# Altium project Multifunctional Probe.PrjPcb
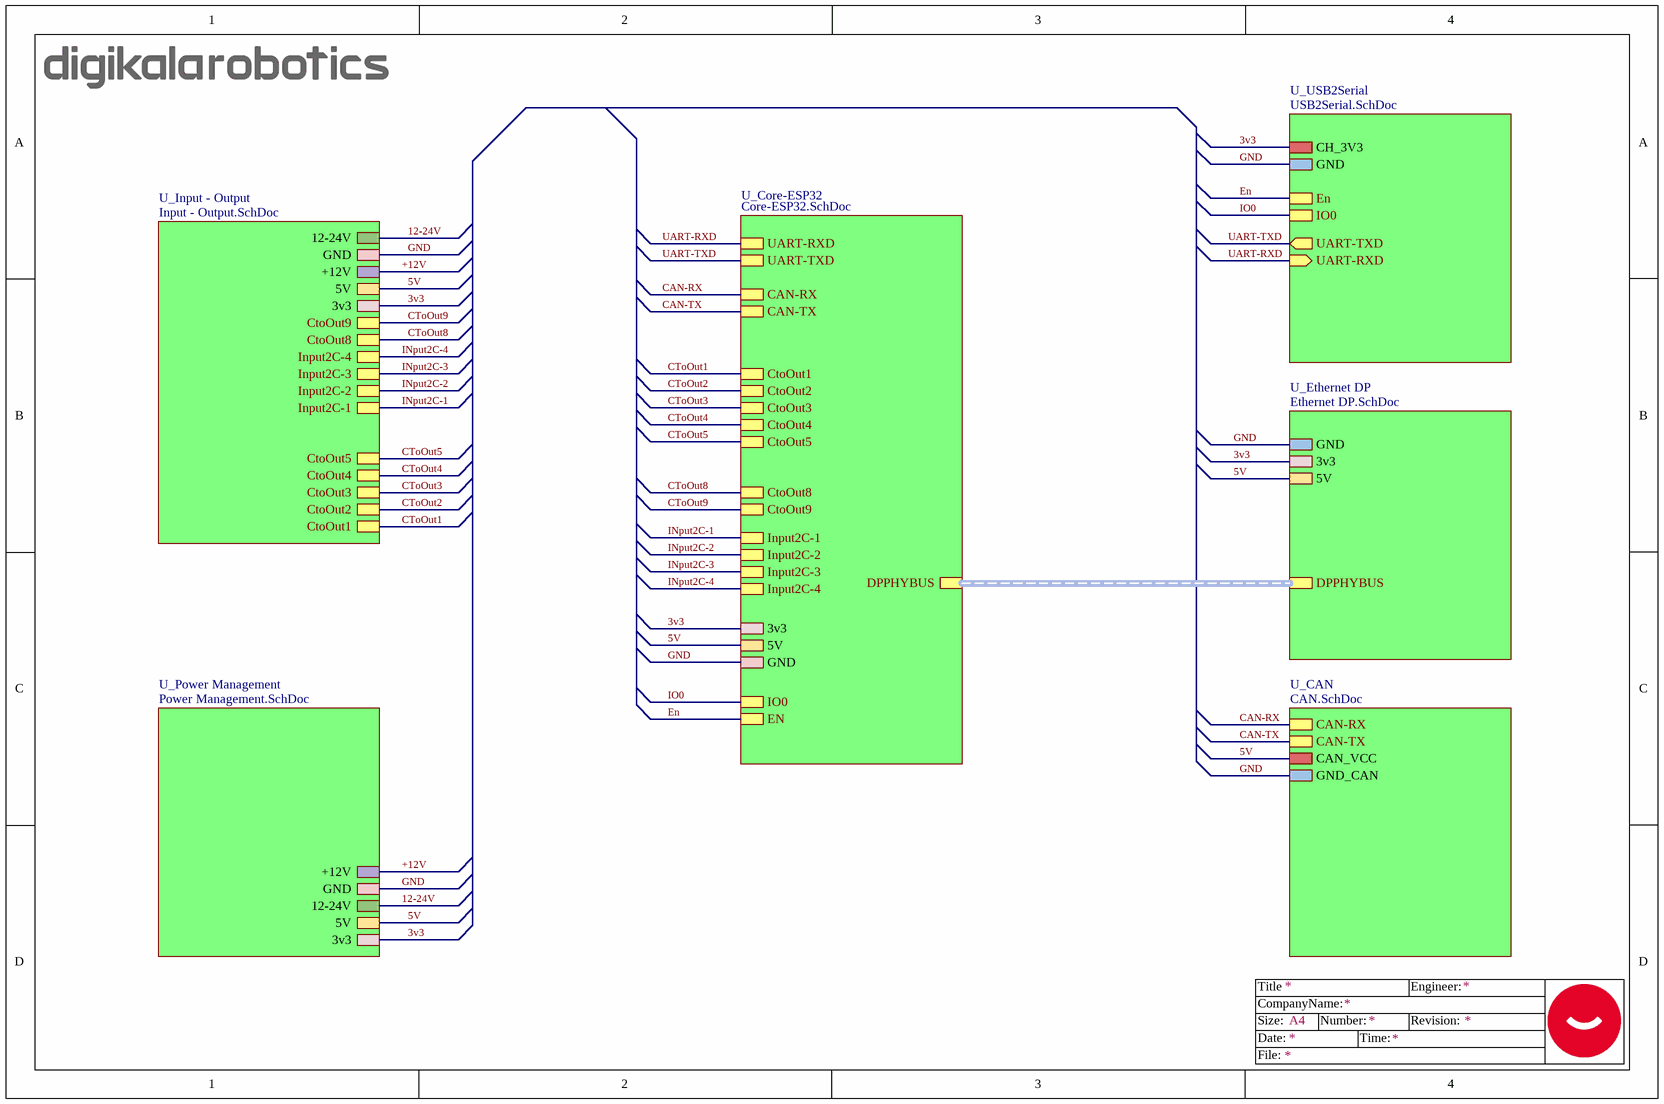
[diagram p0: Dashboard - Multifunctional Probe.SchDoc]
7 sheets, 199 parts. Net scope: hierarchical (ports join the sheet entries above them; power ports are global).
Board file: Multifunctional Probe.PcbDoc
Sheets:
  Dashboard - Multifunctional Probe.SchDoc
    U_CAN = CAN.SchDoc
    U_Core-ESP32 = Core-ESP32.SchDoc
    U_Ethernet DP = Ethernet DP.SchDoc
    U_USB2Serial = USB2Serial.SchDoc
    U_Power Management = Power Management.SchDoc
    U_Input - Output = Input - Output.SchDoc

## Sheet Dashboard - Multifunctional Probe.SchDoc
size A4; SheetNumber: 1; SheetTotal: 7

### Sub-sheets
U_CAN = CAN.SchDoc: CAN-RX, CAN-TX, CAN_VCC, GND_CAN
U_Core-ESP32 = Core-ESP32.SchDoc: UART-RXD, UART-TXD, DPPHYBUS (harness DPPHYBUS), CAN-RX, CAN-TX, CtoOut1, CtoOut2, CtoOut3, CtoOut4, CtoOut8, Input2C-1, Input2C-2, Input2C-3, Input2C-4, 3v3, 5V, GND, CtoOut9, IO0, EN, CtoOut5
U_Ethernet DP = Ethernet DP.SchDoc: DPPHYBUS (harness DPPHYBUS), GND, 3v3, 5V
U_Input - Output = Input - Output.SchDoc: CtoOut1, CtoOut2, CtoOut3, CtoOut4, Input2C-1, Input2C-2, Input2C-3, Input2C-4, CtoOut8, CtoOut9, 3v3, 5V, +12V, GND, 12-24V, CtoOut5
U_Power Management = Power Management.SchDoc: 3v3, 5V, 12-24V, GND, +12V
U_USB2Serial = USB2Serial.SchDoc: CH_3V3, UART-RXD (in), UART-TXD (out), GND, En, IO0

### Nets
3v3: sheet U_Core-ESP32/3v3, sheet U_Ethernet DP/3v3, sheet U_USB2Serial/CH_3V3, sheet U_Power Management/3v3, sheet U_Input - Output/3v3
5V: sheet U_CAN/CAN_VCC, sheet U_Core-ESP32/5V, sheet U_Ethernet DP/5V, sheet U_Power Management/5V, sheet U_Input - Output/5V
12-24V: sheet U_Power Management/12-24V, sheet U_Input - Output/12-24V
+12V: sheet U_Power Management/+12V, sheet U_Input - Output/+12V
GND: sheet U_CAN/GND_CAN, sheet U_Core-ESP32/GND, sheet U_Ethernet DP/GND, sheet U_USB2Serial/GND, sheet U_Power Management/GND, sheet U_Input - Output/GND
CAN-RX: sheet U_CAN/CAN-RX, sheet U_Core-ESP32/CAN-RX
CAN-TX: sheet U_CAN/CAN-TX, sheet U_Core-ESP32/CAN-TX
CToOut1: sheet U_Core-ESP32/CtoOut1, sheet U_Input - Output/CtoOut1
CToOut2: sheet U_Core-ESP32/CtoOut2, sheet U_Input - Output/CtoOut2
CToOut3: sheet U_Core-ESP32/CtoOut3, sheet U_Input - Output/CtoOut3
CToOut4: sheet U_Core-ESP32/CtoOut4, sheet U_Input - Output/CtoOut4
CToOut5: sheet U_Core-ESP32/CtoOut5, sheet U_Input - Output/CtoOut5
CToOut8: sheet U_Core-ESP32/CtoOut8, sheet U_Input - Output/CtoOut8
CToOut9: sheet U_Core-ESP32/CtoOut9, sheet U_Input - Output/CtoOut9
En: sheet U_Core-ESP32/EN, sheet U_USB2Serial/En
INput2C-1: sheet U_Core-ESP32/Input2C-1, sheet U_Input - Output/Input2C-1
INput2C-2: sheet U_Core-ESP32/Input2C-2, sheet U_Input - Output/Input2C-2
INput2C-3: sheet U_Core-ESP32/Input2C-3, sheet U_Input - Output/Input2C-3
INput2C-4: sheet U_Core-ESP32/Input2C-4, sheet U_Input - Output/Input2C-4
IO0: sheet U_Core-ESP32/IO0, sheet U_USB2Serial/IO0  [project net ETH_CLK_IN]
UART-RXD: sheet U_Core-ESP32/UART-RXD, sheet U_USB2Serial/UART-RXD
UART-TXD: sheet U_Core-ESP32/UART-TXD, sheet U_USB2Serial/UART-TXD

### Buses and harness runs
harness sheet U_Core-ESP32/DPPHYBUS = sheet U_Ethernet DP/DPPHYBUS

### Notes on the sheet
- Title
- Size:
- Date:
- CompanyName:
- A4
- Number:
- Time:
- Revision:
- Engineer:
- File:

## Sheet CAN.SchDoc
size A4; SheetNumber: 3; SheetTotal: 7
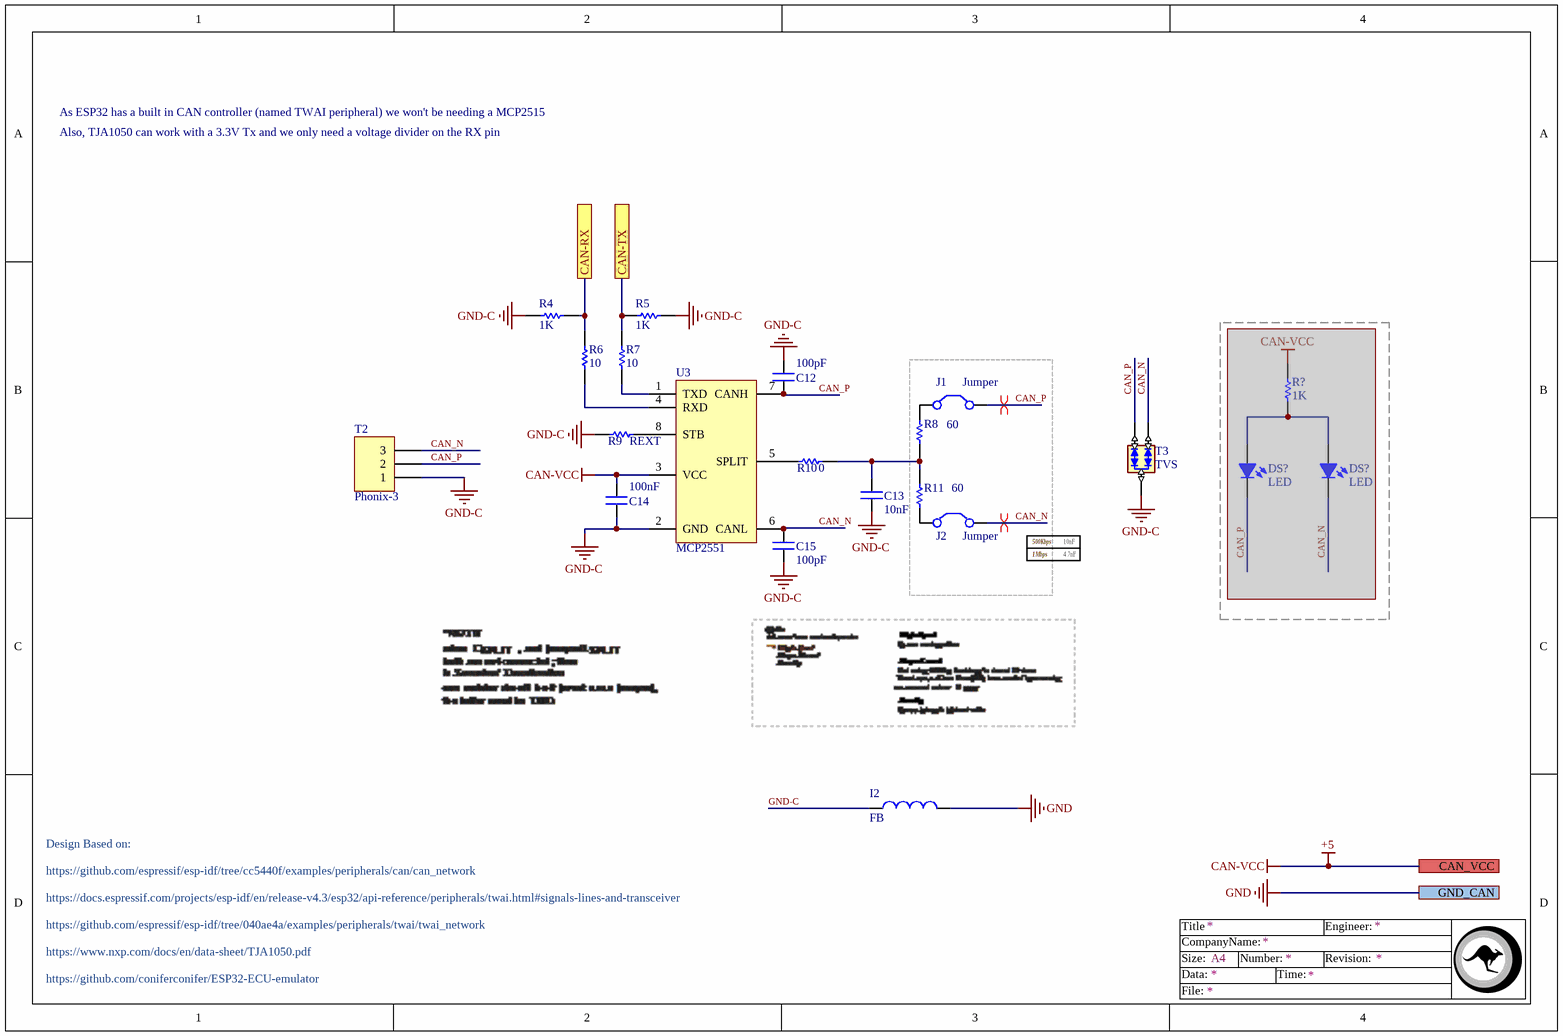
[diagram p1: CAN.SchDoc]

### Parts
(Parts that share a designator on the sheet are numbered #1, #2 ... from top to bottom, then left to right.)
C12  100pF  [Cap0805]
C13  10nF  [Cap0805]
C14  100nF  [Cap0805]
C15  100pF  [Cap0805]
DS?#1  LED  [LED_0805Green]  (masked out: inside a compile mask, not in the netlist)
DS?#2  LED  [LED_0805Green]  (masked out: inside a compile mask, not in the netlist)
I2  FB  [1206]
J1  Jumper  [Jumper Small - 2.54 - Blue]
J2  Jumper  [Jumper Small - 2.54 - Blue]
R4  1K  [R0805]
R5  1K  [R0805]
R6  10  [R0805]
R7  10  [R0805]
R8  60  [R0805]
R9  REXT  [R0805]
R10  0  [R0805]
R11#1  60  [R0805]
R?  1K  [R0805]  (masked out: inside a compile mask, not in the netlist)
T2  Phonix-3  [Phonix-3]
T3  TVS  [SOT23]
U3  MCP2551  [SO4]

### Ports
CAN-RX (see Dashboard - Multifunctional Probe[4C], Core-ESP32[3B]), CAN-TX (see Dashboard - Multifunctional Probe[4C], Core-ESP32[3A]), CAN_VCC (see Dashboard - Multifunctional Probe[4C]), GND_CAN (see Dashboard - Multifunctional Probe[4C])

### Nets
+5: C14.1 U3.3(VCC) ; port CAN_VCC  [also labelled CAN-VCC]  [project net 5V]
GND: I2.2 ; port GND_CAN
GND-C: C12.1 C13.1 C14.2 C15.1 I2.1 R4.2 R5.1 R9.2 T2.1 T3.1(GND) U3.2(GND)
CAN-RX: R4.1 R6.2 ; port CAN-RX
CAN-TX: R5.2 R7.2 ; port CAN-TX
CAN_N: C15.2 J2.2(C2) T2.3 T3.2(CANH) U3.6(CANL)
CAN_P: C12.2 J1.2(C2) T2.2 T3.3(CANL) U3.7(CANH)
NetC13_2: C13.2 R8.2 R10.1 R11#1.2
NetJ1_1: J1.1(C1) R8.1
NetJ2_1: J2.1(C1) R11#1.1
NetR6_1: R6.1 U3.4(RXD)
NetR7_1: R7.1 U3.1(TXD)
NetR9_1: R9.1 U3.8(STB)
NetR10_2: R10.2 U3.5(SPLIT)

### Layout directives
differential pair: CAN_N, CAN_P

### Notes on the sheet
- As ESP32 has a built in CAN controller (named TWAI peripheral) we won't be needing a MCP2515
- Also, TJA1050 can work with a 3.3V Tx and we only need a voltage divider on the RX pin
- Design Based on:
  https://github.com/espressif/esp-idf/tree/cc5440f/examples/peripherals/can/can_network
  https://docs.espressif.com/projects/esp-idf/en/release-v4.3/esp32/api-reference/peripherals/twai.html#signals-lines-and-transceiver
  https://github.com/espressif/esp-idf/tree/040ae4a/examples/peripherals/twai/twai_network
  https://www.nxp.com/docs/en/data-sheet/TJA1050.pdf
  https://github.com/coniferconifer/ESP32-ECU-emulator
- Title
- Size:
- Data:
- CompanyName:
- A4
- Number:
- Time:
- Revision:
- Engineer:
- File:

### Library data of the parts
C12-C15 = Cap: Surface mount Capacitor
I2 = Inductor: Indicator
R4-R10 R11#1 R? = Resistor
T2 = Phonix-3: Connector
T3 = ESD
U3 = MCP2551: CAN IC

## Sheet Core-ESP32.SchDoc
size A4; SheetNumber: 6; SheetTotal: 7
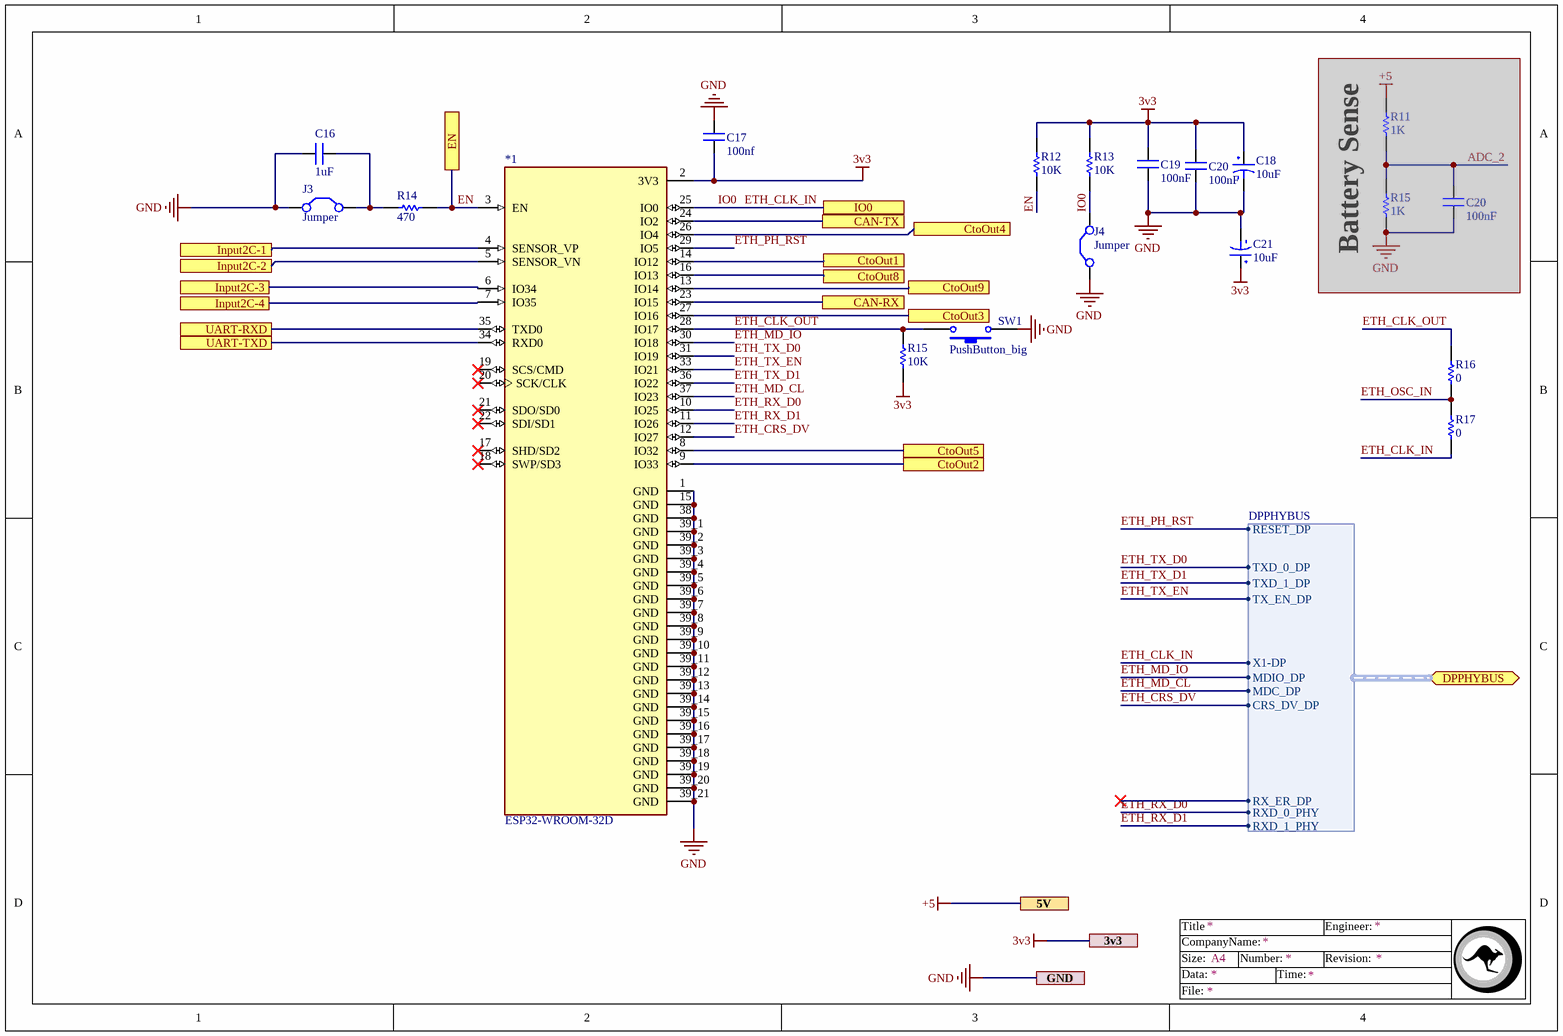
[diagram p2: Core-ESP32.SchDoc]

### Parts
(Parts that share a designator on the sheet are numbered #1, #2 ... from top to bottom, then left to right.)
*1  ESP32-WROOM-32D  [ESP32-Wroom-32D]
C16  1uF  [Cap0805]
C17  100nf  [Cap0805]
C18  10uF  [CAPMOL_B]
C19  100nF  [Cap0805]
C20#1  100nF  [Cap0805]
C20#2  100nF  [Cap0805]  (masked out: inside a compile mask, not in the netlist)
C21  10uF  [CAPMOL_B]
J3  Jumper  [Jumper Small - 2.54 - Blue]
J4  Jumper  [Jumper]
R11#2  1K  [R0805]  (masked out: inside a compile mask, not in the netlist)
R12  10K  [R0805]
R13  10K  [R0805]
R14  470  [R0805]
R15#1  1K  [R0805]  (masked out: inside a compile mask, not in the netlist)
R15#2  10K  [R0805]
R16  0  [R0805]
R17  0  [R0805]
SW1  PushButton_big  [PushButton]

### Ports
3v3 (see Dashboard - Multifunctional Probe[2C], Ethernet DP[4A], Input - Output[3D], Power Management[3C]), 5V (see Dashboard - Multifunctional Probe[2C], Ethernet DP[4A], Input - Output[3D], Power Management[3B]), CAN-RX (see Dashboard - Multifunctional Probe[2B], CAN[2B]), CAN-TX (see Dashboard - Multifunctional Probe[2B], CAN[2B]), CtoOut1 (see Dashboard - Multifunctional Probe[2B], Input - Output[1C]), CtoOut2 (see Dashboard - Multifunctional Probe[2B], Input - Output[1D]), CtoOut3 (see Dashboard - Multifunctional Probe[2B], Input - Output[1D]), CtoOut4 (see Dashboard - Multifunctional Probe[2B], Input - Output[1D]), CtoOut5 (see Dashboard - Multifunctional Probe[2B], Input - Output[1D]), CtoOut8 (see Dashboard - Multifunctional Probe[2B], Input - Output[1B]), CtoOut9 (see Dashboard - Multifunctional Probe[2B], Input - Output[1C]), DPPHYBUS (bidir, harness DPPHYBUS, see Dashboard - Multifunctional Probe[3C], Ethernet DP[4B]), EN (see Dashboard - Multifunctional Probe[2C], USB2Serial[1C]), GND (see Dashboard - Multifunctional Probe[2C], Ethernet DP[3D], Input - Output[3D], Power Management[3D], USB2Serial[2D]), Input2C-1 (see Dashboard - Multifunctional Probe[2B], Input - Output[4B]), Input2C-2 (see Dashboard - Multifunctional Probe[2C], Input - Output[4B]), Input2C-3 (see Dashboard - Multifunctional Probe[2C], Input - Output[4B]), Input2C-4 (see Dashboard - Multifunctional Probe[2C], Input - Output[4B]), IO0 (see Dashboard - Multifunctional Probe[2C], USB2Serial[1D]), UART-RXD (see Dashboard - Multifunctional Probe[2A], USB2Serial[3B]), UART-TXD (see Dashboard - Multifunctional Probe[2A], USB2Serial[3C])

### Harnesses
DPPHYBUS: RESET_DP, TXD_0_DP, X1-DP, TXD_1_DP, TX_EN_DP, MDIO_DP, MDC_DP, CRS_DV_DP, RX_ER_DP, RXD_0_PHY, RXD_1_PHY

### Nets
3v3: *1.2(3V3) C17.1 C18.2 C19.2 C20#1.2 C21.2 R12.1 R13.1 R15#2.2 ; port 3v3
GND: *1.1(GND) *1.15(GND) *1.38(GND) *1.39_1(GND) *1.39_2(GND) *1.39_3(GND) *1.39_4(GND) *1.39_5(GND) *1.39_6(GND) *1.39_7(GND) *1.39_8(GND) *1.39_9(GND) *1.39_10(GND) *1.39_11(GND) *1.39_12(GND) *1.39_13(GND) *1.39_14(GND) *1.39_15(GND) *1.39_16(GND) *1.39_17(GND) *1.39_18(GND) *1.39_19(GND) *1.39_20(GND) *1.39_21(GND) C16.1 C17.2 C18.1 C19.1 C20#1.1 C21.1 J3.1(C1) J4.1(C1) SW1.1 ; port GND
CAN-RX: *1.23(IO15) ; port CAN-RX
CAN-TX: *1.24(IO2) ; port CAN-TX
CToOut1: *1.14(IO12) ; port CtoOut1
CToOut2: *1.9(IO33) ; port CtoOut2
CToOut3: *1.27(IO16) ; port CtoOut3
CToOut4: *1.26(IO4) ; port CtoOut4
CToOut5: *1.8(IO32) ; port CtoOut5
CToOut8: *1.16(IO13) ; port CtoOut8
CToOut9: *1.13(IO14) ; port CtoOut9
En: *1.3(EN) R12.2 R14.1 ; port EN
ETH_CLK_IN: *1.25(IO0) J4.2(C2) R13.2 R17.2 ; port IO0, port DPPHYBUS.X1-DP  [also labelled IO0]
ETH_CLK_OUT: *1.28(IO17) R15#2.1 R16.1 SW1.2
ETH_CRS_DV: *1.12(IO27) ; port DPPHYBUS.CRS_DV_DP  [project net CRS_DV_DP]
ETH_MD_CL: *1.37(IO23) ; port DPPHYBUS.MDC_DP
ETH_MD_IO: *1.30(IO18) ; port DPPHYBUS.MDIO_DP
ETH_OSC_IN: R16.2 R17.1
ETH_PH_RST: *1.29(IO5) ; port DPPHYBUS.RESET_DP
ETH_RX_D0: *1.10(IO25) ; port DPPHYBUS.RXD_0_PHY
ETH_RX_D1: *1.11(IO26) ; port DPPHYBUS.RXD_1_PHY
ETH_TX_D0: *1.31(IO19) ; port DPPHYBUS.TXD_0_DP
ETH_TX_D1: *1.36(IO22) ; port DPPHYBUS.TXD_1_DP
ETH_TX_EN: *1.33(IO21) ; port DPPHYBUS.TX_EN_DP
INput2C-1: *1.4(SENSOR_VP) ; port Input2C-1
INput2C-2: *1.5(SENSOR_VN) ; port Input2C-2
INput2C-3: *1.6(IO34) ; port Input2C-3
INput2C-4: *1.7(IO35) ; port Input2C-4
UART-RXD: *1.35(TXD0) ; port UART-RXD
UART-TXD: *1.34(RXD0) ; port UART-TXD
NetC16_2: C16.2 J3.2(C2) R14.2

Not connected (* = marked no-connect by the designer): *1 17(SHD/SD2)* 18(SWP/SD3)* 19(SCS/CMD)* 20(SCK/CLK)* 21(SDO/SD0)* 22(SDI/SD1)*

### Notes on the sheet
- Battery Sense
- Title
- Size:
- Data:
- CompanyName:
- A4
- Number:
- Time:
- Revision:
- Engineer:
- File:

### Library data of the parts
C16 C17 C19 C20#1 C20#2 = Cap: Surface mount Capacitor
C18 C21 = Cap_P: Polarity
R11#2 R12-R14 R15#1 R15#2 R16 R17 = Resistor

## Sheet Ethernet DP.SchDoc
size A4; SheetNumber: 7; SheetTotal: 7
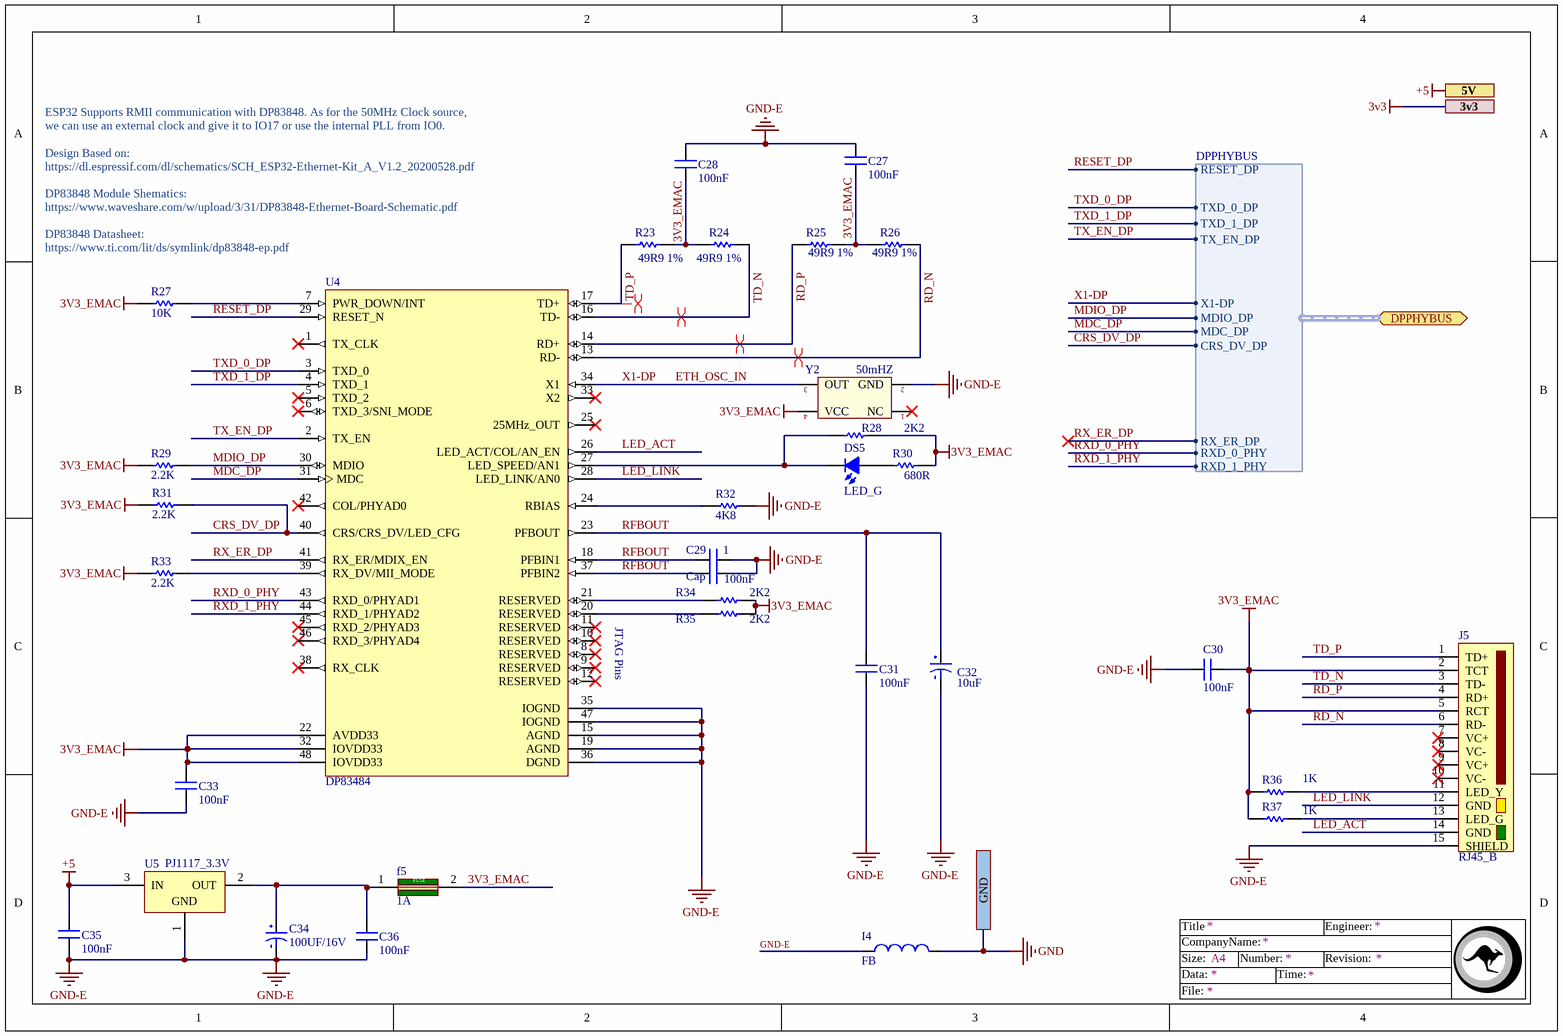
[diagram p3: Ethernet DP.SchDoc]

### Parts
1  Cap  [Cap0805]
C27  100nF  [Cap0805]
C28  100nF  [Cap0805]
C29  100nF  [Cap0805]
C30  100nF  [Cap0805]
C31  100nF  [Cap0805]
C32  10uF  [CAPMOL_B]
C33  100nF  [Cap0805]
C34  100UF/16V  [CAPMOL_A]
C35  100nF  [Cap0805]
C36  100nF  [Cap0805]
DS5  LED_G  [LED_0805Green]
f5  1A  [1206]
I4  FB  [1206]
J5  RJ45_B  [RJ45_B]
R23  49R9 1%  [R0805]
R24  49R9 1%  [R0805]
R25  49R9 1%  [R0805]
R26  49R9 1%  [R0805]
R27  10K  [R0805]
R28  2K2  [R0805]
R29  2.2K  [R0805]
R30  680R  [R0805]
R31  2.2K  [R0805]
R32  4K8  [R0805]
R33  2.2K  [R0805]
R34  2K2  [R0805]
R35  2K2  [R0805]
R36  1K  [R0805]
R37  1K  [R0805]
U4  DP83484  [DP83484]
U5  PJ1117_3.3V  [PJ1117s]
Y2  50mHZ  [Crystall 50Mhz]

### Ports
3v3 (see Dashboard - Multifunctional Probe[4B], Core-ESP32[3D], Input - Output[3D], Power Management[3C]), 5V (see Dashboard - Multifunctional Probe[4B], Core-ESP32[3D], Input - Output[3D], Power Management[3B]), DPPHYBUS (bidir, harness DPPHYBUS, see Dashboard - Multifunctional Probe[4C], Core-ESP32[4C]), GND (see Dashboard - Multifunctional Probe[4B], Core-ESP32[3D], Input - Output[3D], Power Management[3D], USB2Serial[2D])

### Harnesses
DPPHYBUS: RESET_DP, TXD_0_DP, X1-DP, TXD_1_DP, TX_EN_DP, MDIO_DP, MDC_DP, CRS_DV_DP, RX_ER_DP, RXD_0_PHY, RXD_1_PHY

### Nets
3V3_EMAC: C27.1 C28.1 C30.2 C33.1 f5.2(OUT) J5.2(TCT) J5.5(RCT) R23.1 R24.2 R25.1 R26.2 R27.2 R28.1 R29.2 R30.1 R31.2 R33.2 R34.1 R35.1 R36.2 R37.2 U4.22(AVDD33) U4.32(IOVDD33) U4.48(IOVDD33) Y2.4(VCC)
+5: C35.2 U5.3(IN) ; port 5V  [project net 5V]
GND: I4.2 ; port GND
GND-E: 1.2 C27.2 C28.2 C29.2 C30.1 C31.1 C32.1 C33.2 C34.1 C35.1 C36.1 I4.1 J5.15(SHIELD) R32.1 U4.15(AGND) U4.19(AGND) U4.35(IOGND) U4.36(DGND) U4.47(IOGND) U5.1(GND) Y2.2(GND)
CRS_DV_DP: R31.1 U4.40(CRS/CRS_DV/LED_CFG) ; port DPPHYBUS.CRS_DV_DP
ETH_OSC_IN: U4.34(X1) Y2.3(OUT) ; port DPPHYBUS.X1-DP  [also labelled X1-DP]  [project net ETH_CLK_IN]
LED_ACT: J5.14(GND) U4.26(LED_ACT/COL/AN_EN)
LED_LINK: J5.12(GND) U4.28(LED_LINK/AN0)
MDC_DP: U4.31(MDC) ; port DPPHYBUS.MDC_DP  [project net ETH_MD_CL]
MDIO_DP: R29.1 U4.30(MDIO) ; port DPPHYBUS.MDIO_DP  [project net ETH_MD_IO]
RD_N: J5.6(RD-) R26.1 U4.13(RD-)
RD_P: J5.4(RD+) R25.2 U4.14(RD+)
RESET_DP: U4.29(RESET_N) ; port DPPHYBUS.RESET_DP  [project net ETH_PH_RST]
RFBOUT: 1.1 C29.1 C31.2 C32.2 U4.18(PFBIN1) U4.23(PFBOUT) U4.37(PFBIN2)
RX_ER_DP: U4.41(RX_ER/MDIX_EN) ; port DPPHYBUS.RX_ER_DP
RXD_0_PHY: U4.43(RXD_0/PHYAD1) ; port DPPHYBUS.RXD_0_PHY  [project net ETH_RX_D0]
RXD_1_PHY: U4.44(RXD_1/PHYAD2) ; port DPPHYBUS.RXD_1_PHY  [project net ETH_RX_D1]
TD_N: J5.3(TD-) R24.1 U4.16(TD-)
TD_P: J5.1(TD+) R23.2 U4.17(TD+)
TX_EN_DP: U4.2(TX_EN) ; port DPPHYBUS.TX_EN_DP  [project net ETH_TX_EN]
TXD_0_DP: U4.3(TXD_0) ; port DPPHYBUS.TXD_0_DP  [project net ETH_TX_D0]
TXD_1_DP: U4.4(TXD_1) ; port DPPHYBUS.TXD_1_DP  [project net ETH_TX_D1]
NetC34_2: C34.2 C36.2 f5.1(IN) U5.2(OUT)
NetDS5_A: DS5.A R30.2
NetDS5_K: DS5.K R28.2 U4.27(LED_SPEED/AN1)
NetJ5_11: J5.11(LED_Y) R36.1
NetJ5_13: J5.13(LED_G) R37.1
NetR27_1: R27.1 U4.7(PWR_DOWN/INT)
NetR32_2: R32.2 U4.24(RBIAS)
NetR33_1: R33.1 U4.39(RX_DV/MII_MODE)
NetR34_2: R34.2 U4.21(RESERVED)
NetR35_2: R35.2 U4.20(RESERVED)

Not connected (* = marked no-connect by the designer): J5 7(VC+)* 8(VC-)* 9(VC+)* 10(VC-)*; U4 1(TX_CLK)* 5(TXD_2)* 6(TXD_3/SNI_MODE)* 8(RESERVED)* 9(RESERVED)* 10(RESERVED)* 11(RESERVED)* 12(RESERVED)* 25(25MHz_OUT)* 33(X2)* 38(RX_CLK)* 42(COL/PHYAD0)* 45(RXD_2/PHYAD3)* 46(RXD_3/PHYAD4)*; Y2 1(NC)*

### Layout directives
differential pair: RD_N, RD_P, TD_N, TD_P

### Notes on the sheet
- ESP32 Supports RMII communication with DP83848. As for the 50MHz Clock source, we can use an external clock and give it to IO17 or use the internal PLL from IO0.
- Design Based on:
  https://dl.espressif.com/dl/schematics/SCH_ESP32-Ethernet-Kit_A_V1.2_20200528.pdf
  DP83848 Module Shematics:
  https://www.waveshare.com/w/upload/3/31/DP83848-Ethernet-Board-Schematic.pdf
  DP83848 Datasheet:
  https://www.ti.com/lit/ds/symlink/dp83848-ep.pdf
- (near U4) JTAG Pins
- Title
- Size:
- Data:
- CompanyName:
- A4
- Number:
- Time:
- Revision:
- Engineer:
- File:
- (in symbol Fuse) FUSE

### Library data of the parts
1 C27-C31 C33 C35 C36 = Cap: Surface mount Capacitor
C32 C34 = Cap_P: Polarity
DS5 = LED
f5 = Fuse
I4 = Inductor: Indicator
J5 = RJ45_B: Ethernet Connector
R23-R37 = Resistor
U4 = DP83484: Ethernet PHY
U5 = PJ1117_3.3V: Regulator
Y2 = Oscillator

## Sheet USB2Serial.SchDoc
size A4; SheetNumber: 5; SheetTotal: 7
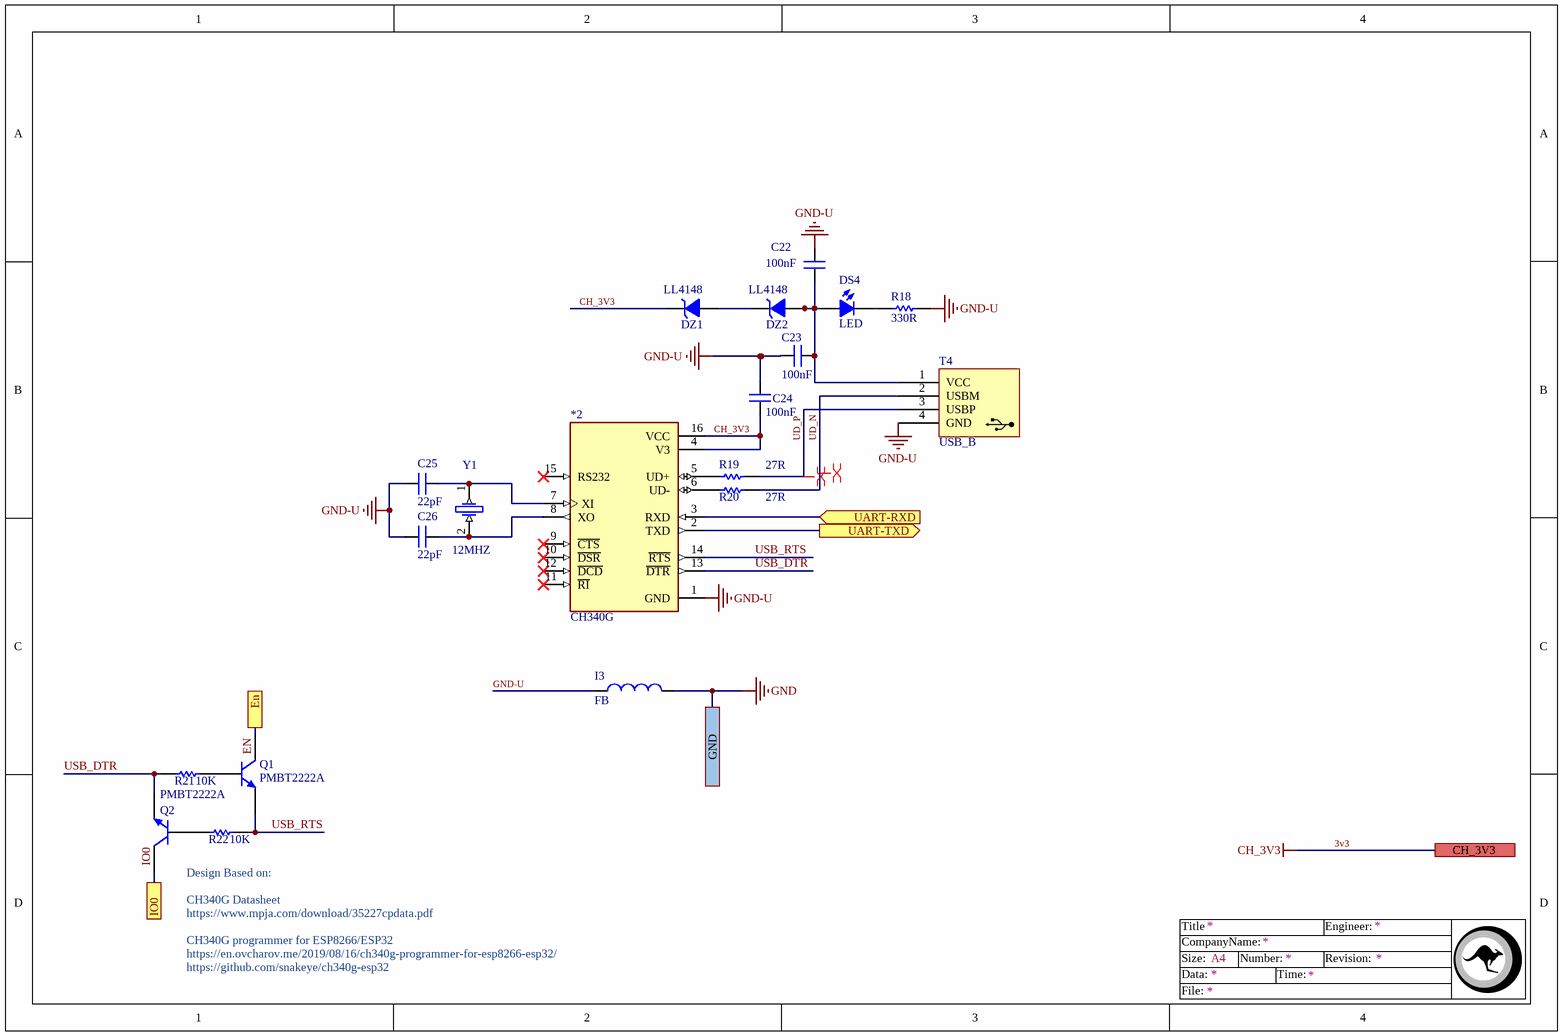
[diagram p4: USB2Serial.SchDoc]

### Parts
*2  CH340G  [SOIC127P600X180-16N]
C22  100nF  [Cap0805]
C23  100nF  [Cap0805]
C24  100nF  [Cap0805]
C25  22pF  [Cap0805]
C26  22pF  [Cap0805]
DS4  LED  [LED_0805Green]
DZ1  LL4148  [LL4148]
DZ2  LL4148  [LL4148]
I3  FB  [1206]
Q1  PMBT2222A  [SOT23_BEC_N]
Q2  PMBT2222A  [SOT23_BEC_N]
R18  330R  [R0805]
R19  27R  [R0805]
R20  27R  [R0805]
R21  10K  [R0805]
R22  10K  [R0805]
T4  USB_B  [USB_Dip_R]
Y1  12MHZ  [Crystal SMD]

### Ports
CH_3V3 (see Dashboard - Multifunctional Probe[4A]), En (see Dashboard - Multifunctional Probe[4A], Core-ESP32[2A]), GND (see Dashboard - Multifunctional Probe[4A], Core-ESP32[3D], Ethernet DP[3D], Input - Output[3D], Power Management[3D]), IO0 (see Dashboard - Multifunctional Probe[4A], Core-ESP32[3A]), UART-RXD (in, see Dashboard - Multifunctional Probe[4A], Core-ESP32[1B]), UART-TXD (out, see Dashboard - Multifunctional Probe[4A], Core-ESP32[1B])

### Nets
3v3: *2.4(V3) *2.16(VCC) C24.2 DZ1.K ; port CH_3V3  [also labelled CH_3V3]
GND: I3.2 ; port GND
GND-U: *2.1(GND) C22.2 C23.2 C24.1 C25.2 C26.2 I3.1 R18.1 T4.4(GND)
En: Q1.3(C) ; port En
ETH_CLK_IN: Q2.3(C) ; port IO0
UART-RXD: *2.3(RXD) ; port UART-RXD
UART-TXD: *2.2(TXD) ; port UART-TXD
UD_N: R20.1 T4.2(USBM)
UD_P: R19.1 T4.3(USBP)
USB_DTR: *2.13(~{DTR}) Q2.2(E) R21.2
USB_RTS: *2.14(~{RTS}) Q1.2(E) R22.1
Net*2_5: *2.5(UD+) R19.2
Net*2_6: *2.6(UD-) R20.2
Net*2_7: *2.7(XI) C25.1 Y1.1
Net*2_8: *2.8(XO) C26.1 Y1.2
NetC22_1: C22.1 C23.1 DS4.A DZ2.A T4.1(VCC)
NetDS4_K: DS4.K R18.2
NetDZ1_A: DZ1.A DZ2.K
NetQ1_1: Q1.1(B) R21.1
NetQ2_1: Q2.1(B) R22.2

Not connected (* = marked no-connect by the designer): *2 9(~{CTS})* 10(~{DSR})* 11(~{RI})* 12(~{DCD})* 15(RS232)*

### Layout directives
differential pair: UD_N, UD_P

### Notes on the sheet
- Design Based on:
  CH340G Datasheet
  https://www.mpja.com/download/35227cpdata.pdf
  CH340G programmer for ESP8266/ESP32
  https://en.ovcharov.me/2019/08/16/ch340g-programmer-for-esp8266-esp32/
  https://github.com/snakeye/ch340g-esp32
- Labels drawn without touching a wire or pin: EN, IO0
- Title
- Size:
- Data:
- CompanyName:
- A4
- Number:
- Time:
- Revision:
- Engineer:
- File:

### Library data of the parts
C22-C26 = Cap: Surface mount Capacitor
DZ1 DZ2 = Diode Zener
I3 = Inductor: Indicator
Q1 Q2 = NPN: NPN Bipolar Transistor; Published: 8-Jun-2000; LatestRevisionDate: 29-May-2009; LatestRevisionNote: IPC-7351 Footprint Added.; PackageVersion: Aug-1999; PackageReference: SOT-23B; Publisher: Altium Limited; PackageDescription: 3-Pin SOT-23 Package 0.95 mm Pitch, 2.4 mm Lead Span
R18-R22 = Resistor
T4 = USB_B: USB B Connector
Y1 = Crystal

## Sheet Power Management.SchDoc
size A4; SheetNumber: 2; SheetTotal: 7
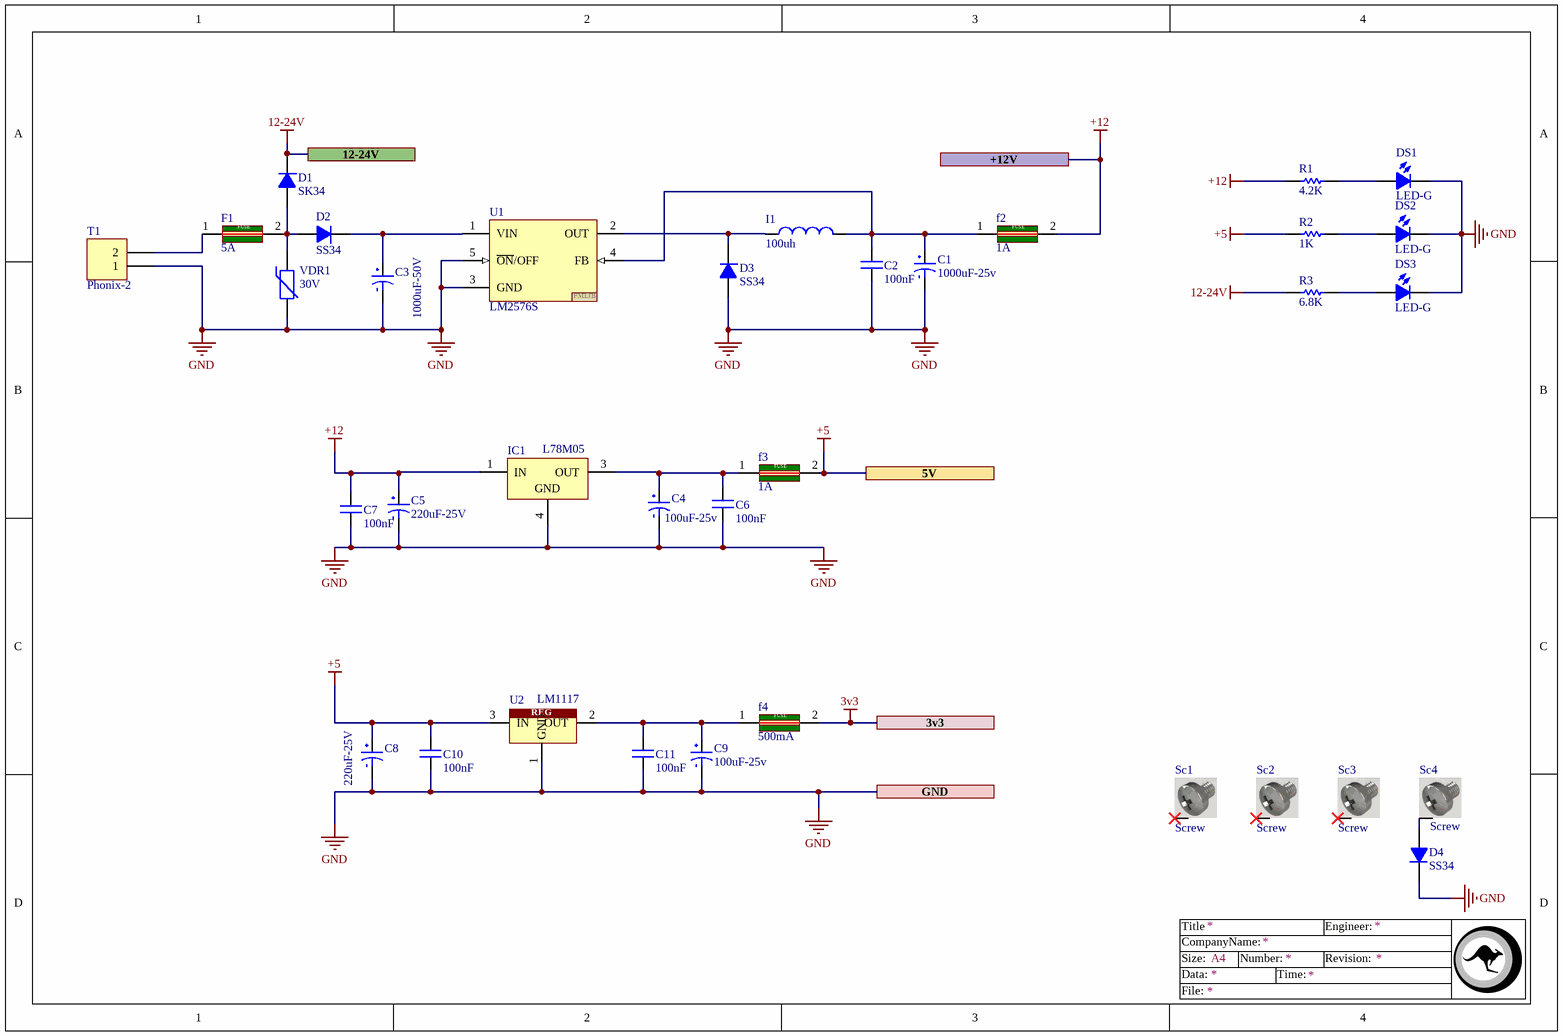
[diagram p5: Power Management.SchDoc]

### Parts
C1  1000uF-25v  [Cap_4mm]
C2  100nF  [CAP1206]
C3  1000uF-50V  [Cap_5mm]
C4  100uF-25v  [Cap_4mm]
C5  220uF-25V  [Cap_4mm]
C6  100nF  [Cap0805]
C7  100nF  [Cap0805]
C8  220uF-25V  [CAPMOL_B]
C9  100uF-25v  [CAPMOL_B]
C10  100nF  [Cap0805]
C11  100nF  [Cap0805]
D1  SK34  [Diod-3A-SMD]
D2  SS34  [Diod-1A-SMD]
D3  SS34  [Diod-1A-SMD]
D4  SS34  [Diod-1A-SMD]
DS1  LED-G  [Led0805]
DS2  LED-G  [Led0805]
DS3  LED-G  [Led0805]
F1  5A  [Fuse SMD]
f2  1A  [1206]
f3  1A  [1206]
f4  500mA  [1206]
I1  100uh  [INDUCTORSquare]
IC1  L78M05  [TO-252]
R1  4.2K  [R0805]
R2  1K  [R0805]
R3  6.8K  [R0805]
Sc1  Screw  [Screw]
Sc2  Screw  [Screw]
Sc3  Screw  [Screw]
Sc4  Screw  [Screw]
T1  Phonix-2  [Phonix-2]
U1  LM2576S  [LM2576S]
U2  LM1117  [DPACK]
VDR1  30V  [Varistor]

### Ports
3v3 (see Dashboard - Multifunctional Probe[1D], Core-ESP32[3D], Ethernet DP[4A], Input - Output[3D]), 5V (see Dashboard - Multifunctional Probe[1D], Core-ESP32[3D], Ethernet DP[4A], Input - Output[3D]), 12-24V (see Dashboard - Multifunctional Probe[1D], Input - Output[3D]), +12V (see Dashboard - Multifunctional Probe[1D], Input - Output[3D]), GND (see Dashboard - Multifunctional Probe[1D], Core-ESP32[3D], Ethernet DP[3D], Input - Output[3D], USB2Serial[2D])

### Nets
3v3: f4.2(OUT) ; port 3v3
12-24V: D1.K R3.2 ; port 12-24V
+5: C8.2 C10.2 f3.2(OUT) R2.2 U2.3(IN) ; port 5V  [project net 5V]
+12: C5.2 C7.2 f2.2(OUT) IC1.1(IN) R1.2 ; port +12V  [project net +12V]
GND: C1.1 C2.1 C3.1 C4.1 C5.1 C6.1 C7.1 C8.1 C9.1 C10.1 C11.1 D3.A D4.K DS1.K DS2.K DS3.K IC1.4(GND) T1.1 U1.3(GND) U1.5(~{ON}/OFF) U2.1(GND) VDR1.1 ; port GND
NetC1_2: C1.2 C2.2 f2.1(IN) I1.2 U1.4(FB)
NetC3_2: C3.2 D2.K U1.1(VIN)
NetC4_2: C4.2 C6.2 f3.1(IN) IC1.3(OUT)
NetC9_2: C9.2 C11.2 f4.1(IN) U2.2(OUT)
NetD1_A: D1.A D2.A F1.2(OUT) VDR1.2
NetD3_K: D3.K I1.1 U1.2(OUT)
NetD4_A: D4.A Sc4.S
NetDS1_A: DS1.A R1.1
NetDS2_A: DS2.A R2.1
NetDS3_A: DS3.A R3.1
NetF1_1: F1.1(IN) T1.2

Not connected (* = marked no-connect by the designer): Sc1 S*; Sc2 S*; Sc3 S*

### Notes on the sheet
- Title
- Size:
- Data:
- CompanyName:
- A4
- Number:
- Time:
- Revision:
- Engineer:
- File:
- (in symbol Fuse) FUSE
- (in symbol LM1117) REG
- (in symbol LM2576S) PMLIB

### Library data of the parts
C1 C3-C5 C8 C9 = Cap_P: Polarity
C2 C6 C7 C10 C11 = Cap: Surface mount Capacitor
D1-D4 = Diode
DS1-DS3 = LED
F1 f2-f4 = Fuse
I1 = Inductor: Indicator
IC1 = L78M05: Precision 500mA Regulator
R1-R3 = Resistor
Sc1-Sc4 = Screw: Screw 3mm
T1 = Phonix-2: Connector
U1 = LM2576S: Regulator
U2 = LM1117: Regulator
VDR1 = Varistor

## Sheet Input - Output.SchDoc
size A4; SheetNumber: 4; SheetTotal: 7
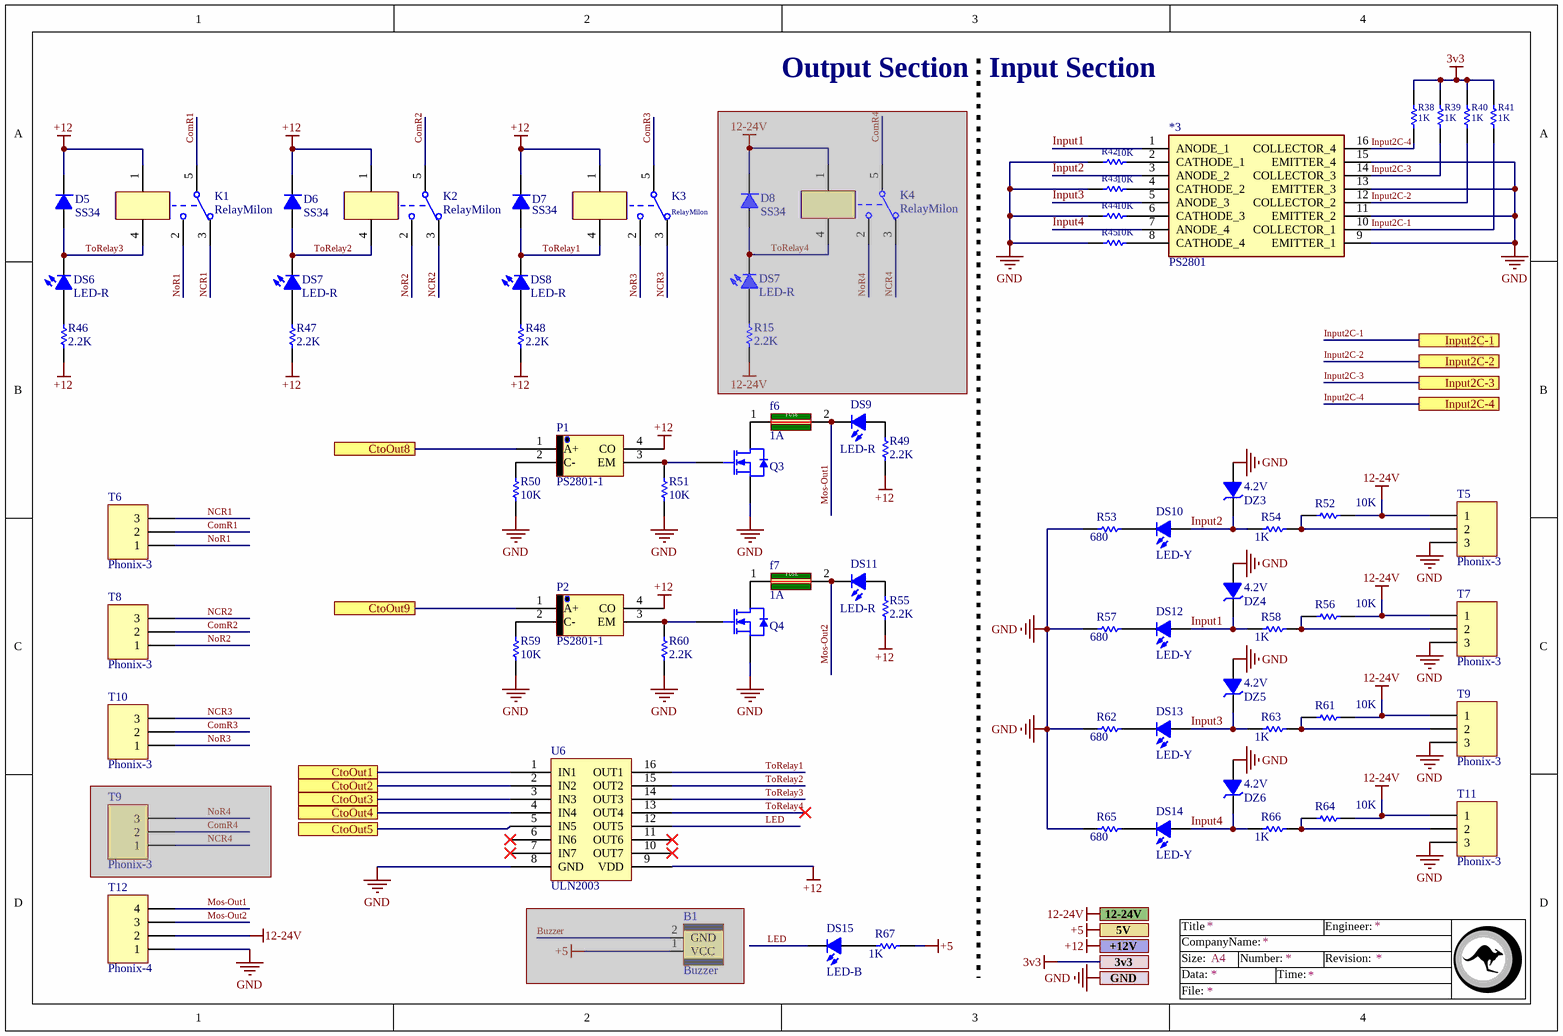
[diagram p6: Input - Output.SchDoc]

### Parts
(Parts that share a designator on the sheet are numbered #1, #2 ... from top to bottom, then left to right.)
*3  PS2801  [PS2801]
B1  Buzzer  [Buzzer]  (masked out: inside a compile mask, not in the netlist)
D5  SS34  [Diod-1A-SMD]
D6  SS34  [Diod-1A-SMD]
D7  SS34  [Diod-1A-SMD]
D8  SS34  [Diod-1A-SMD]  (masked out: inside a compile mask, not in the netlist)
DS6  LED-R  [Led0805]
DS7#1  LED-R  [Led0805]
DS7#2  LED-R  [Led0805]  (masked out: inside a compile mask, not in the netlist)
DS8  LED-R  [Led0805]
DS9  LED-R  [Led0805]
DS10  LED-Y  [Led0805]
DS11  LED-R  [Led0805]
DS12  LED-Y  [Led0805]
DS13  LED-Y  [Led0805]
DS14  LED-Y  [Led0805]
DS15  LED-B  [LED - DipS]
DZ3  4.2V  [LL4148]
DZ4  4.2V  [LL4148]
DZ5  4.2V  [LL4148]
DZ6  4.2V  [LL4148]
f6  1A  [1206]
f7  1A  [1206]
K1  RelayMilon  [Relay_MILONBIG]
K2  RelayMilon  [Relay_MILONBIG]
K3  RelayMilon  [Relay_MILONBIG]
K4  RelayMilon  [Relay_MILONBIG]  (masked out: inside a compile mask, not in the netlist)
P1  PS2801-1  [PS2801-1]
P2  PS2801-1  [PS2801-1]
Q3  MOSFET-N  [TO252-S]  (value not drawn)
Q4  MOSFET-N  [TO252-S]  (value not drawn)
R15#3  2.2K  [R0805]  (masked out: inside a compile mask, not in the netlist)
R38  1K  [R0805]
R39  1K  [R0805]
R40  1K  [R0805]
R41  1K  [R0805]
R42  10K  [R0805]
R43  10K  [R0805]
R44  10K  [R0805]
R45  10K  [R0805]
R46  2.2K  [R0805]
R47  2.2K  [R0805]
R48  2.2K  [R0805]
R49  2.2K  [R0805]
R50  10K  [R0805]
R51  10K  [R0805]
R52  10K  [R0805]
R53  680  [R0805]
R54  1K  [R0805]
R55  2.2K  [R0805]
R56  10K  [R0805]
R57  680  [R0805]
R58  1K  [R0805]
R59  10K  [R0805]
R60  2.2K  [R0805]
R61  10K  [R0805]
R62  680  [R0805]
R63  1K  [R0805]
R64  10K  [R0805]
R65  680  [R0805]
R66  1K  [R0805]
R67  1K  [R0805]
T5  Phonix-3  [Phonix-3]
T6  Phonix-3  [Phonix-3]
T7  Phonix-3  [Phonix-3]
T8  Phonix-3  [Phonix-3]
T9#1  Phonix-3  [Phonix-3]
T9#2  Phonix-3  [Phonix-3]  (masked out: inside a compile mask, not in the netlist)
T10  Phonix-3  [Phonix-3]
T11  Phonix-3  [Phonix-3]
T12  Phonix-4  [Phonix-4]
U6  ULN2003  [SO16]

### Ports
3v3 (see Dashboard - Multifunctional Probe[1B], Core-ESP32[3D], Ethernet DP[4A], Power Management[3C]), 5V (see Dashboard - Multifunctional Probe[1B], Core-ESP32[3D], Ethernet DP[4A], Power Management[3B]), 12-24V (see Dashboard - Multifunctional Probe[1A], Power Management[1A]), +12V (see Dashboard - Multifunctional Probe[1A], Power Management[3A]), CtoOut1 (see Dashboard - Multifunctional Probe[1B], Core-ESP32[3A]), CtoOut2 (see Dashboard - Multifunctional Probe[1B], Core-ESP32[3B]), CtoOut3 (see Dashboard - Multifunctional Probe[1B], Core-ESP32[3B]), CtoOut4 (see Dashboard - Multifunctional Probe[1B], Core-ESP32[3A]), CtoOut5 (see Dashboard - Multifunctional Probe[1B], Core-ESP32[3B]), CtoOut8 (see Dashboard - Multifunctional Probe[1B], Core-ESP32[3B]), CtoOut9 (see Dashboard - Multifunctional Probe[1B], Core-ESP32[3B]), GND (see Dashboard - Multifunctional Probe[1A], Core-ESP32[3D], Ethernet DP[3D], Power Management[3D], USB2Serial[2D]), Input2C-1 (see Dashboard - Multifunctional Probe[1B], Core-ESP32[1A]), Input2C-2 (see Dashboard - Multifunctional Probe[1B], Core-ESP32[1B]), Input2C-3 (see Dashboard - Multifunctional Probe[1B], Core-ESP32[1B]), Input2C-4 (see Dashboard - Multifunctional Probe[1B], Core-ESP32[1B])

### Nets
3v3: R38.1 R39.1 R40.1 R41.1 ; port 3v3
12-24V: R52.1 R56.1 R61.1 R64.1 T5.1 T7.1 T9#1.1 T11.1 T12.2 ; port 12-24V
+5: R67.1 ; port 5V  [project net 5V]
+12: D5.K D6.K D7.K K1.1 K2.1 K3.1 P1.4(CO) P2.4(CO) R46.2 R47.2 R48.2 R49.2 R55.2 U6.9(VDD) ; port +12V  [project net +12V]
GND: *3.9(EMITTER_1) *3.11(EMITTER_2) *3.13(EMITTER_3) *3.15(EMITTER_4) DZ3.A DZ4.A DZ5.A DZ6.A Q3.3 Q4.3 R42.2 R43.2 R44.2 R45.2 R50.2 R51.2 R53.2 R57.2 R59.2 R60.2 R62.2 R65.2 T5.3 T7.3 T9#1.3 T11.3 T12.1 U6.8(GND) ; port GND
ComR1: K1.5 T6.2
ComR2: K2.5 T8.2
ComR3: K3.5 T10.2
CToOut1: U6.1(IN1) ; port CtoOut1
CToOut2: U6.2(IN2) ; port CtoOut2
CToOut3: U6.3(IN3) ; port CtoOut3
CToOut4: U6.4(IN4) ; port CtoOut4
CToOut5: U6.5(IN5) ; port CtoOut5
CToOut8: P1.1(A+) ; port CtoOut8
CToOut9: P2.1(A+) ; port CtoOut9
Input1: *3.1(ANODE_1) DS12.A DZ4.K R58.2
Input2: *3.3(ANODE_2) DS10.A DZ3.K R54.2
INput2C-1: *3.10(COLLECTOR_1) R41.2 ; port Input2C-1
INput2C-2: *3.12(COLLECTOR_2) R40.2 ; port Input2C-2
INput2C-3: *3.14(COLLECTOR_3) R39.2 ; port Input2C-3
INput2C-4: *3.16(COLLECTOR_4) R38.2 ; port Input2C-4
Input3: *3.5(ANODE_3) DS13.A DZ5.K R63.2
Input4: *3.7(ANODE_4) DS14.A DZ6.K R66.2
LED: DS15.K U6.12(OUT5)
Mos-Out1: DS9.K f6.2(OUT) T12.4
Mos-Out2: DS11.K f7.2(OUT) T12.3
NCR1: K1.3 T6.3
NCR2: K2.3 T8.3
NCR3: K3.3 T10.3
NoR1: K1.2 T6.1
NoR2: K2.2 T8.1
NoR3: K3.2 T10.1
ToRelay1: D7.A DS8.K K3.4 U6.16(OUT1)
ToRelay2: D6.A DS7#1.K K2.4 U6.15(OUT2)
ToRelay3: D5.A DS6.K K1.4 U6.14(OUT3)
ToRelay4: U6.13(OUT4)
Net*3_2: *3.2(CATHODE_1) R42.1
Net*3_4: *3.4(CATHODE_2) R43.1
Net*3_6: *3.6(CATHODE_3) R44.1
Net*3_8: *3.8(CATHODE_4) R45.1
NetDS6_A: DS6.A R46.1
NetDS7#1_A: DS7#1.A R47.1
NetDS8_A: DS8.A R48.1
NetDS9_A: DS9.A R49.1
NetDS10_K: DS10.K R53.1
NetDS11_A: DS11.A R55.1
NetDS12_K: DS12.K R57.1
NetDS13_K: DS13.K R62.1
NetDS14_K: DS14.K R65.1
NetDS15_A: DS15.A R67.2
Netf6_1: f6.1(IN) Q3.4
Netf7_1: f7.1(IN) Q4.4
NetP1_2: P1.2(C-) R50.1
NetP1_3: P1.3(EM) Q3.1 R51.1
NetP2_2: P2.2(C-) R59.1
NetP2_3: P2.3(EM) Q4.1 R60.1
NetR52_2: R52.2 R54.1 T5.2
NetR56_2: R56.2 R58.1 T7.2
NetR61_2: R61.2 R63.1 T9#1.2
NetR64_2: R64.2 R66.1 T11.2

Not connected (* = marked no-connect by the designer): U6 6(IN6)* 7(IN7)* 10(OUT7)* 11(OUT6)*

### Notes on the sheet
- Output Section
- Input Section
- Title
- Size:
- Data:
- CompanyName:
- A4
- Number:
- Time:
- Revision:
- Engineer:
- File:
- (in symbol Fuse) FUSE

### Library data of the parts
D5-D8 = Diode
DS6 DS7#1 DS7#2 DS8-DS15 = LED
DZ3-DZ6 = Diode Zener
f6 f7 = Fuse
Q3 Q4 = MOSFET-N: MOSFET, N-Channel
R15#3 R38-R67 = Resistor
T5-T8 T9#1 T9#2 T10 T11 = Phonix-3: Connector
T12 = Phonix-4: Connector
U6 = ULN2003: High-voltage, high-current Darlington arrays

## Nets that join several sheets
3v3: Core-ESP32 (9 pins), USB2Serial (*2.4 *2.16 C24.2 DZ1.K), Power Management (f4.2), Input - Output (R38.1 R39.1 R40.1 R41.1)
5V: CAN (C14.1 U3.3), Ethernet DP (C35.2 U5.3), Power Management (5 pins), Input - Output (R67.1)
12-24V: Power Management (D1.K R3.2), Input - Output (9 pins)
+12V: Power Management (5 pins), Input - Output (14 pins)
GND: CAN (I2.2), Core-ESP32 (33 pins), Ethernet DP (I4.2), USB2Serial (I3.2), Power Management (22 pins), Input - Output (28 pins)
CAN-RX: CAN (R4.1 R6.2), Core-ESP32 (*1.23)
CAN-TX: CAN (R5.2 R7.2), Core-ESP32 (*1.24)
CRS_DV_DP: Core-ESP32 (*1.12), Ethernet DP (R31.1 U4.40)
CToOut1: Core-ESP32 (*1.14), Input - Output (U6.1)
CToOut2: Core-ESP32 (*1.9), Input - Output (U6.2)
CToOut3: Core-ESP32 (*1.27), Input - Output (U6.3)
CToOut4: Core-ESP32 (*1.26), Input - Output (U6.4)
CToOut5: Core-ESP32 (*1.8), Input - Output (U6.5)
CToOut8: Core-ESP32 (*1.16), Input - Output (P1.1)
CToOut9: Core-ESP32 (*1.13), Input - Output (P2.1)
En: Core-ESP32 (*1.3 R12.2 R14.1), USB2Serial (Q1.3)
ETH_CLK_IN: Core-ESP32 (*1.25 J4.2 R13.2 R17.2), Ethernet DP (U4.34 Y2.3), USB2Serial (Q2.3)
ETH_MD_CL: Core-ESP32 (*1.37), Ethernet DP (U4.31)
ETH_MD_IO: Core-ESP32 (*1.30), Ethernet DP (R29.1 U4.30)
ETH_PH_RST: Core-ESP32 (*1.29), Ethernet DP (U4.29)
ETH_RX_D0: Core-ESP32 (*1.10), Ethernet DP (U4.43)
ETH_RX_D1: Core-ESP32 (*1.11), Ethernet DP (U4.44)
ETH_TX_D0: Core-ESP32 (*1.31), Ethernet DP (U4.3)
ETH_TX_D1: Core-ESP32 (*1.36), Ethernet DP (U4.4)
ETH_TX_EN: Core-ESP32 (*1.33), Ethernet DP (U4.2)
INput2C-1: Core-ESP32 (*1.4), Input - Output (*3.10 R41.2)
INput2C-2: Core-ESP32 (*1.5), Input - Output (*3.12 R40.2)
INput2C-3: Core-ESP32 (*1.6), Input - Output (*3.14 R39.2)
INput2C-4: Core-ESP32 (*1.7), Input - Output (*3.16 R38.2)
UART-RXD: Core-ESP32 (*1.35), USB2Serial (*2.3)
UART-TXD: Core-ESP32 (*1.34), USB2Serial (*2.2)